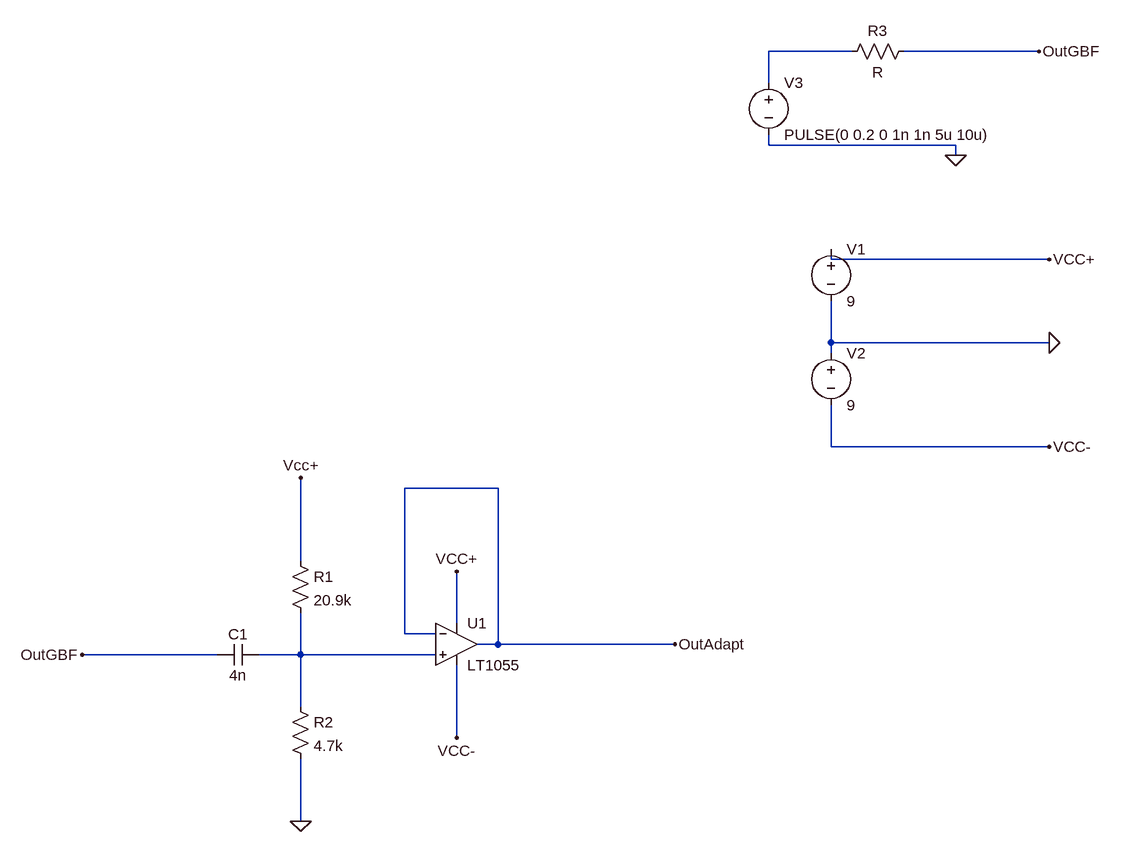
[diagram p0: schematic Cablage4.asc]
Cablage4.asc, the LTspice schematic file:
Version 4
SHEET 1 1224 680
WIRE 832 -896 704 -896
WIRE 1120 -896 912 -896
WIRE 704 -848 704 -896
WIRE 704 -752 704 -768
WIRE 992 -752 704 -752
WIRE 992 -736 992 -752
WIRE 800 -576 800 -592
WIRE 1136 -576 800 -576
WIRE 800 -448 800 -512
WIRE 1136 -448 800 -448
WIRE 800 -432 800 -448
WIRE 800 -288 800 -352
WIRE 1136 -288 800 -288
WIRE 288 -224 144 -224
WIRE -16 -112 -16 -240
WIRE 224 -16 224 -96
WIRE 144 0 144 -224
WIRE 192 0 144 0
WIRE 288 16 288 -224
WIRE 288 16 256 16
WIRE 560 16 288 16
WIRE -144 32 -352 32
WIRE -16 32 -16 -32
WIRE -16 32 -80 32
WIRE 192 32 -16 32
WIRE -16 112 -16 32
WIRE 224 160 224 48
WIRE -16 288 -16 192
FLAG 224 -96 VCC+
FLAG 224 160 VCC-
FLAG -16 288 0
FLAG -16 -240 Vcc+
FLAG 560 16 OutAdapt
FLAG -352 32 OutGBF
FLAG 1136 -576 VCC+
FLAG 1136 -288 VCC-
FLAG 1136 -448 0
FLAG 992 -736 0
FLAG 1120 -896 OutGBF
SYMBOL OpAmps\\LT1055 224 -48 R0
SYMATTR InstName U1
SYMBOL cap -80 16 R90
WINDOW 0 0 32 VBottom 2
WINDOW 3 32 32 VTop 2
SYMATTR InstName C1
SYMATTR Value 4n
SYMBOL res -32 -128 R0
SYMATTR InstName R1
SYMATTR Value 20.9k
SYMBOL res -32 96 R0
SYMATTR InstName R2
SYMATTR Value 4.7k
SYMBOL voltage 800 -608 R0
WINDOW 123 0 0 Left 0
WINDOW 39 0 0 Left 0
SYMATTR InstName V1
SYMATTR Value 9
SYMBOL voltage 800 -448 R0
WINDOW 123 0 0 Left 0
WINDOW 39 0 0 Left 0
SYMATTR InstName V2
SYMATTR Value 9
SYMBOL voltage 704 -864 R0
WINDOW 123 0 0 Left 0
WINDOW 39 0 0 Left 0
SYMATTR InstName V3
SYMATTR Value PULSE(0 0.2 0 1n 1n 5u 10u)
SYMBOL res 928 -912 R90
WINDOW 0 0 56 VBottom 2
WINDOW 3 32 56 VTop 2
SYMATTR InstName R3

The netlist it stands for:
* Cablage4.asc
XU1 N002 OutAdapt VCC+ VCC- OutAdapt LT1055  ; pins In+ In- V+ V- OUT
C1 N002 OutGBF 4n
R1 VCC+ N002 20.9k
R2 N002 0 4.7k
V1 VCC+ 0 9
V2 0 VCC- 9
V3 N001 0 PULSE(0 0.2 0 1n 1n 5u 10u)
R3 OutGBF N001 R
.backanno
.end